# Altium project scoreboard.PrjPcb
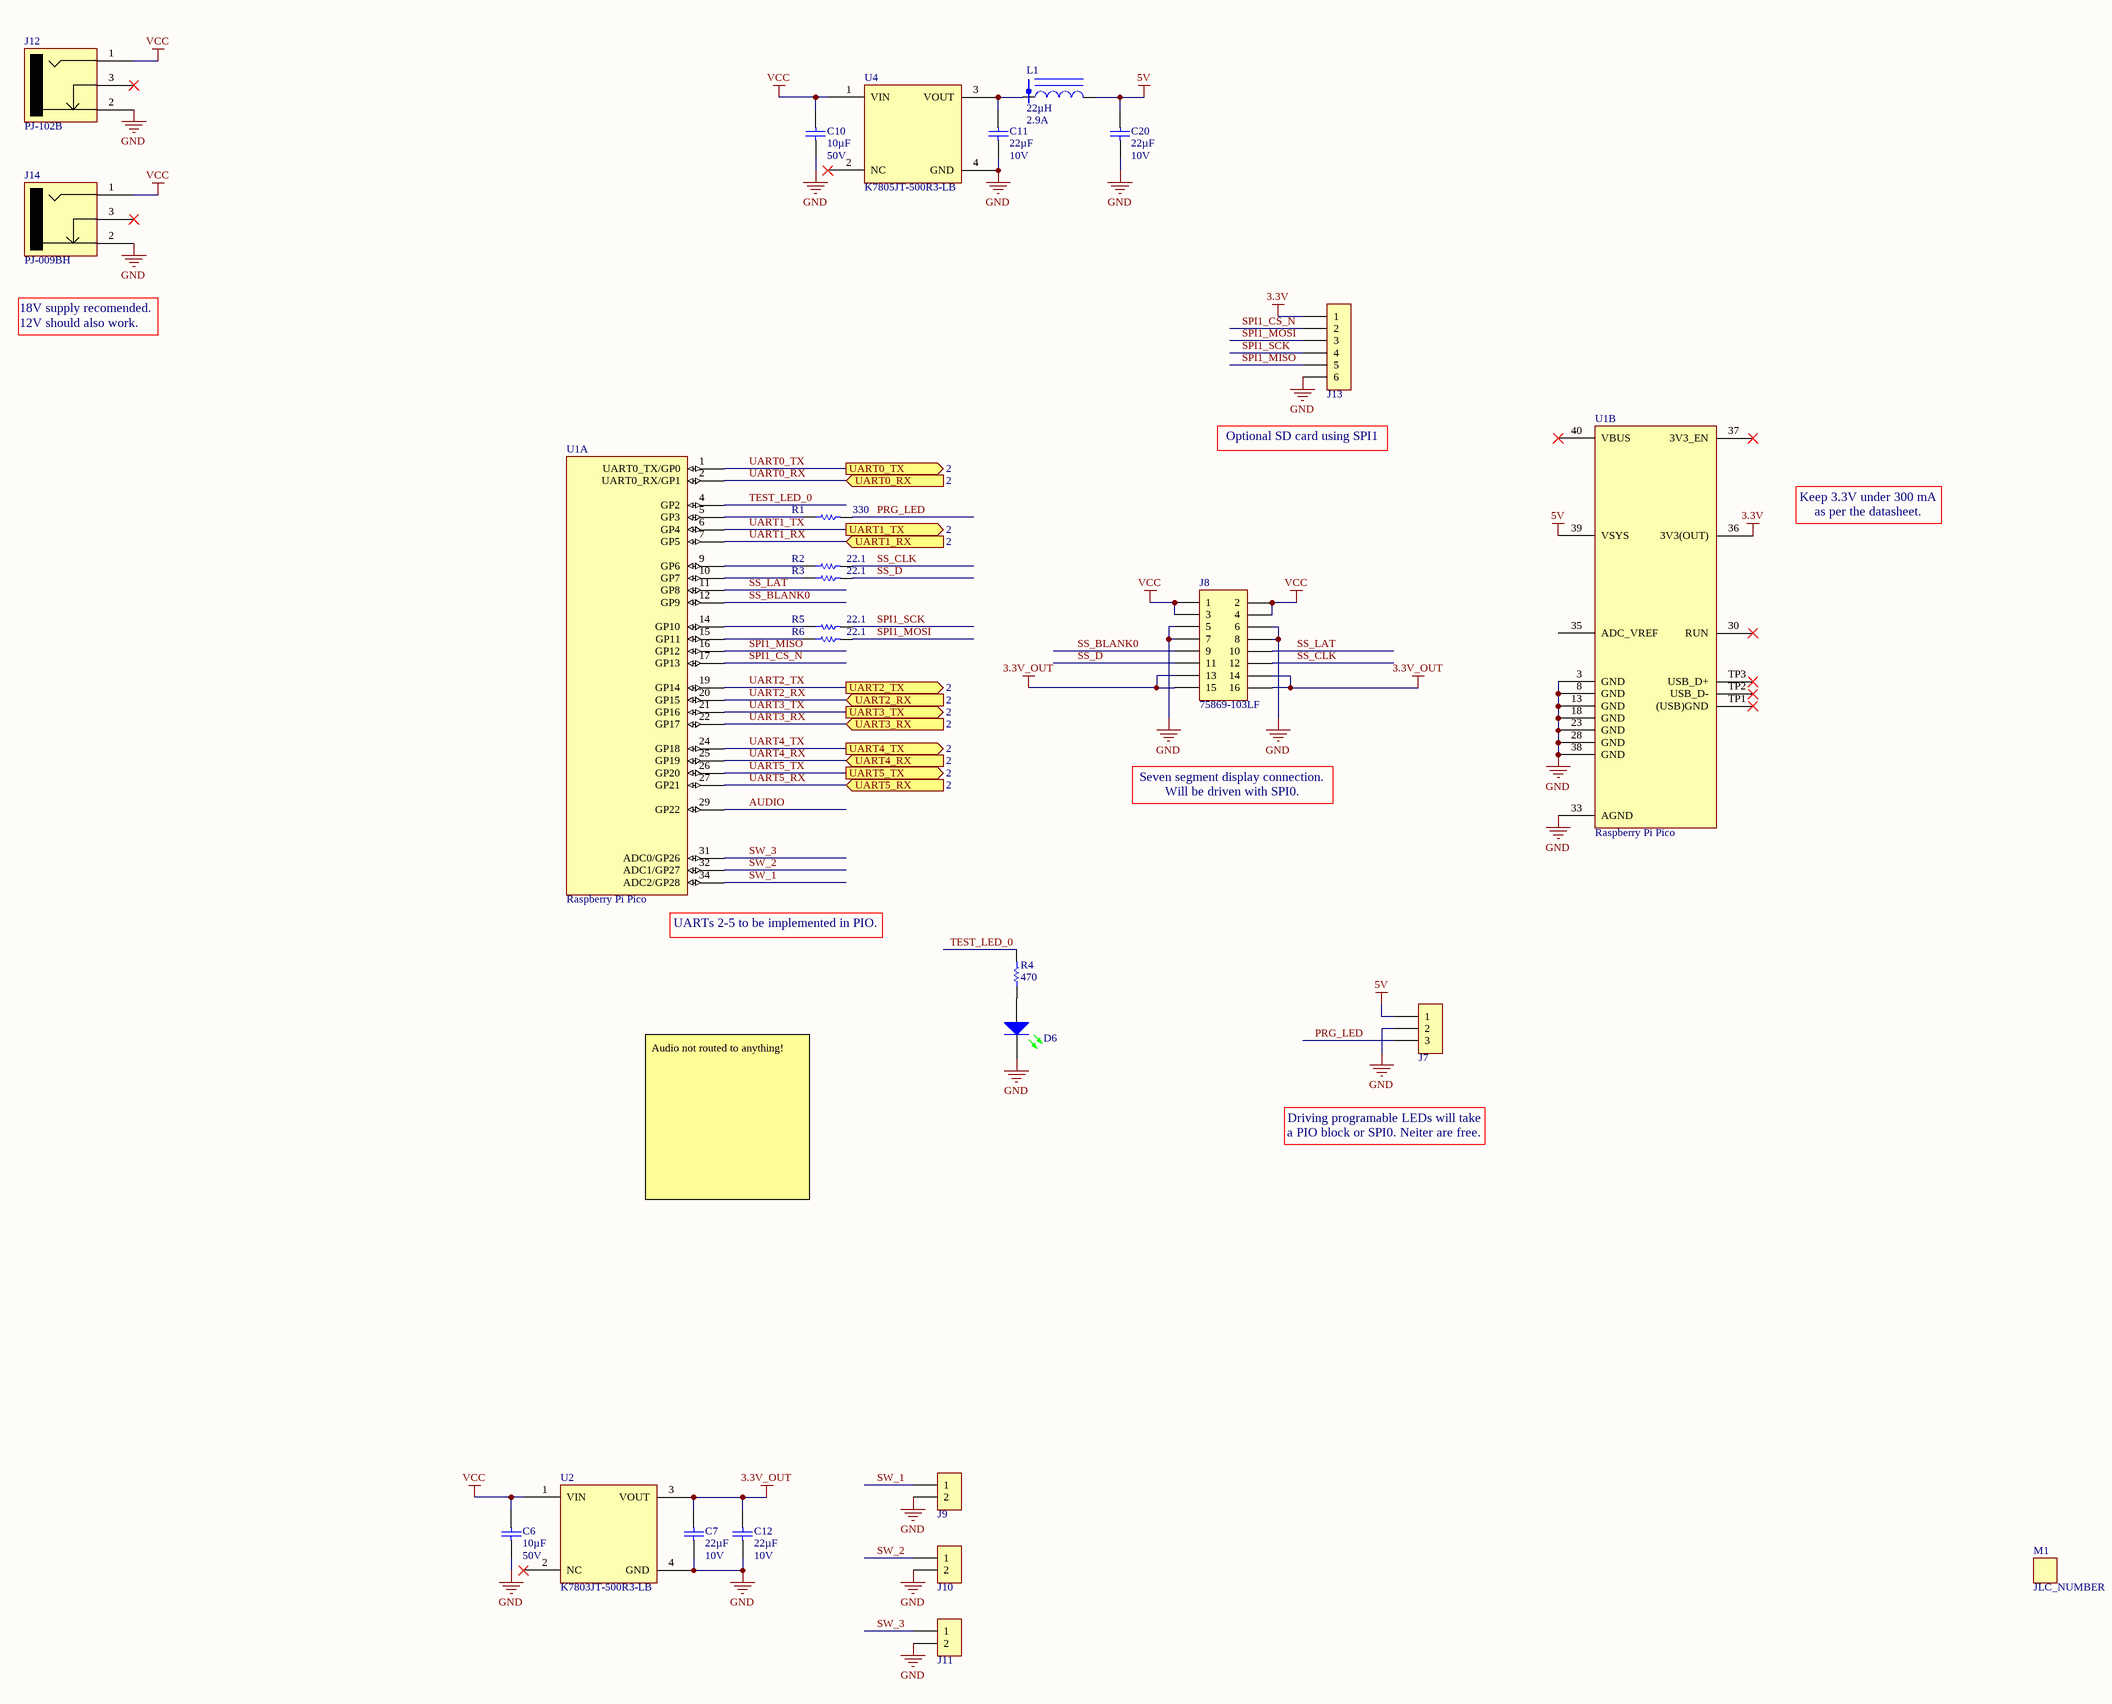
[diagram p0: pico.SchDoc]
BOMRev: A; Codename: Scoreboard; HardRev: A; LeadEngineer: JCF
2 sheets, 56 parts. Net scope: flat (ports and power ports of the same name join across sheets).
Board file: scoreboard.PcbDoc
Sheets:
  pico.SchDoc
  RS232.SchDoc

## Sheet pico.SchDoc: Pico
size C; DocumentNumber: 1; SheetNumber: 1; SheetTotal: 2

### Parts
C6  10µF  Voltage: 50V  [Chip1206]
C7  22µF  Voltage: 10V  [Chip0805]
C10  10µF  Voltage: 50V  [Chip1206]
C11  22µF  Voltage: 10V  [Chip0805]
C12  22µF  Voltage: 10V  [Chip0805]
C20  22µF  Voltage: 10V  [Chip0805]
D6  GREEN  [LED0603]  (value not drawn)
J7  3-644456-3  [TE_3-644456-3]  (value not drawn)
J8  75869-103LF  [IDC_100_2x8]
J9  B2B-XH-A  [JST_B2B-XH-A]  (value not drawn)
J10  B2B-XH-A  [JST_B2B-XH-A]  (value not drawn)
J11  B2B-XH-A  [JST_B2B-XH-A]  (value not drawn)
J12  PJ-102B  [CUI_PJ-102B]
J13  3-644456-6  [TE_3-644456-6]  (value not drawn)
J14  PJ-009BH  [CUI_PJ-009BH]
L1  22µH  Current Rating: 2.9A  [Sumida_CDRH105R]
M1  JLC_NUMBER  [JLC_NUMBER]  (no BOM)
R1  330  [Chip0805]
R2  22.1  [Chip0805]
R3  22.1  [Chip0805]
R4  470  [Chip0805]
R5  22.1  [Chip0805]
R6  22.1  [Chip0805]
U1  Raspberry Pi Pico  [RASPBERRY_PI_PICO]  (parts A,B of 2)
U2  K7803JT-500R3-LB  [MORNSUN_K78XXJT-500R3-LB]
U4  K7805JT-500R3-LB  [MORNSUN_K78XXJT-500R3-LB]

### Ports
UART0_RX (in, see 2), UART0_TX (out, see 2), UART1_RX (in, see 2), UART1_TX (out, see 2), UART2_RX (in, see 2), UART2_TX (out, see 2), UART3_RX (in, see 2), UART3_TX (out, see 2), UART4_RX (in, see 2), UART4_TX (out, see 2), UART5_RX (in, see 2), UART5_TX (out, see 2)

### Nets
3.3V: J13.1 U1.36(3V3(OUT))
3.3V_OUT: C7.2 C12.2 J8.13 J8.14 J8.15 J8.16 U2.3(VOUT)
5V: C20.2 J7.1 L1.2 U1.39(VSYS)
GND: C6.1 C7.1 C10.1 C11.1 C12.1 C20.1 D6.2(C) J7.2 J8.5 J8.6 J8.7 J8.8 J9.2 J10.2 J11.2 J12.2 J13.6 J14.2 U1.3(GND) U1.8(GND) U1.13(GND) U1.18(GND) U1.23(GND) U1.28(GND) U1.33(AGND) U1.38(GND) U2.4(GND) U4.4(GND)
VCC: C6.2 C10.2 J8.1 J8.2 J8.3 J8.4 J12.1 J14.1 U2.1(VIN) U4.1(VIN)
AUDIO: U1.29(GP22)
PRG_LED: J7.3 R1.2
SPI1_CS_N: J13.2 U1.17(GP13)
SPI1_MISO: J13.5 U1.16(GP12)
SPI1_MOSI: J13.3 R6.2
SPI1_SCK: J13.4 R5.2
SS_BLANK0: J8.9 U1.12(GP9)
SS_CLK: J8.12 R2.2
SS_D: J8.11 R3.2
SS_LAT: J8.10 U1.11(GP8)
SW_1: J9.1 U1.34(ADC2/GP28)
SW_2: J10.1 U1.32(ADC1/GP27)
SW_3: J11.1 U1.31(ADC0/GP26)
TEST_LED_0: R4.2 U1.4(GP2)
UART0_RX: U1.2(UART0_RX/GP1) ; port UART0_RX
UART0_TX: U1.1(UART0_TX/GP0) ; port UART0_TX
UART1_RX: U1.7(GP5) ; port UART1_RX
UART1_TX: U1.6(GP4) ; port UART1_TX
UART2_RX: U1.20(GP15) ; port UART2_RX
UART2_TX: U1.19(GP14) ; port UART2_TX
UART3_RX: U1.22(GP17) ; port UART3_RX
UART3_TX: U1.21(GP16) ; port UART3_TX
UART4_RX: U1.25(GP19) ; port UART4_RX
UART4_TX: U1.24(GP18) ; port UART4_TX
UART5_RX: U1.27(GP21) ; port UART5_RX
UART5_TX: U1.26(GP20) ; port UART5_TX
NetC11_2: C11.2 L1.1 U4.3(VOUT)
NetD6_1: D6.1(A) R4.1
NetR1_1: R1.1 U1.5(GP3)
NetR2_1: R2.1 U1.9(GP6)
NetR3_1: R3.1 U1.10(GP7)
NetR5_1: R5.1 U1.14(GP10)
NetR6_1: R6.1 U1.15(GP11)

Not connected (* = marked no-connect by the designer): J12 3*; J14 3*; U1 30(RUN)* 35(ADC_VREF) 37(3V3_EN)* 40(VBUS)* TP1((USB)GND)* TP2(USB_D-)* TP3(USB_D+)*; U2 2(NC)*; U4 2(NC)*

### Notes on the sheet
- 18V supply recomended. 12V should also work.
- Optional SD card using SPI1
- Keep 3.3V under 300 mA as per the datasheet.
- Seven segment display connection. Will be driven with SPI0.
- (near U1) UARTs 2-5 to be implemented in PIO.
- Driving programable LEDs will take a PIO block or SPI0. Neiter are free.
- Audio not routed to anything!
- Title:
- This work is licensed under a Creative Commons Attribution 4.0 International License. Derivative works should remove all Sophistry branding and ‘é’ watermark.
- Date:
- Engineer:
- Revision:
- Codename:
- Time:
- Variant:
- Sheet
- of

### Library data of the parts
C6 C10 = C3216X5R1H106K160AB: CAP CER 10UF 50V 10% X5R 1206; Manufacturer: TDK Corporation; PartNumber: C3216X5R1H106K160AB; HelpURL: http://product.tdk.com/capacitor/mlcc/en/documents/mlcc_commercial_general_en.pdf; Supplier 1: Digi-Key; Supplier Part Number 1: 445-5998-1-ND; Supplier 2: Mouser; Manufacturer Part Number: C3216X5R1H106K160AB; Series: C; Capacitance: 10µF; Tolerance: ±10%; Temperature Coefficient: X5R; Mounting Type: Surface Mount, MLCC; Operating Temperature: -55°C ~ 85°C; Applications: General Purpose; Ratings: -; Package / Case: 1206 (3216 Metric); Size / Dimension: 0.126" L x 0.063" W (3.20mm x 1.60mm); Height - Seated (Max): -; Thickness (Max): 0.071" (1.80mm); Lead Spacing: -; Features: -; Lead Style: -
C7 C11 C12 C20 = C2012X5R1A226M085AC: CAP CER 22UF 10V 20% X5R 0805; Manufacturer: TDK Corporation; PartNumber: C2012X5R1A226M085AC; HelpURL: http://product.tdk.com/capacitor/mlcc/en/documents/mlcc_commercial_general_en.pdf; Supplier 1: Digi-Key; Supplier Part Number 1: 445-7663-1-ND; Supplier 2: Mouser; Manufacturer Part Number: C2012X5R1A226M085AC; Series: C; Capacitance: 22µF; Tolerance: ±20%; Temperature Coefficient: X5R; Mounting Type: Surface Mount, MLCC; Operating Temperature: -55°C ~ 85°C; Applications: General Purpose; Ratings: -; Package / Case: 0805 (2012 Metric); Size / Dimension: 0.079" L x 0.049" W (2.00mm x 1.25mm); Height - Seated (Max): -; Thickness (Max): 0.037" (0.95mm); Lead Spacing: -; Features: -; Lead Style: -
D6 = LTST-C191GKT: LED GREEN CLEAR THIN 0603 SMD; Manufacturer: Lite-On Inc; PartNumber: LTST-C191GKT; Datasheets: http://optoelectronics.liteon.com/upload/download/DS22-2000-300/S_110_LTST-C191TGKT.pdf; Supplier 1: Digi-Key; Supplier Part Number 1: 160-1443-1-ND; Supplier 2: Mouser; Supplier Part Number 2: 859-LTST-C191GKT; Manufacturer Part Number: LTST-C191GKT; Color: Green
J7 = 3-644456-3: CONN HEADER VERT 3POS .100 TIN; Manufacturer: TE Connectivity; PartNumber: 3-644456-3; Supplier 1: Digi-Key; Supplier 2: Mouser; Supplier Part Number 2: 571-3-644456-3; HelpURL: http://www.te.com/commerce/DocumentDelivery/DDEController?Action=srchrtrv&DocNm=644456&DocType=Customer+Drawing&DocLang=English; Supplier Part Number 1: A31113-ND; Manufacturer Part Number: 3-644456-3
J8 = 75869-103LF: CONN HEADER 16POS DUAL VERT PCB; Manufacturer: FCI; PartNumber: 75869-103LF; Supplier 1: Digi-Key; Supplier 2: Mouser; Supplier Part Number 2: 649-75869-103LF; HelpURL: http://portal.fciconnect.com/Comergent//fci/drawing/75869.pdf; Supplier Part Number 1: 609-1775-ND; Manufacturer Part Number: 75869-103LF
J9-J11 = B2B-XH-A: CONN HEADER VERT 2POS 2.5MM; Manufacturer: JST Sales America Inc.; PartNumber: B2B-XH-A; Supplier 1: Digi-Key; Supplier 2: Mouser; HelpURL: https://www.jst-mfg.com/product/pdf/eng/eXH.pdf; Supplier Part Number 1: 455-B2B-XH-A-ND; Manufacturer Part Number: B2B-XH-A
J12 = PJ-102B: CONN PWR JACK 2.5X5.5MM SOLDER; Manufacturer: CUI Devices; PartNumber: PJ-102B; HelpURL: https://www.cuidevices.com/product/resource/pj-102b.pdf; Supplier 1: Digi-Key; Supplier Part Number 1: CP-102B-ND; Supplier 2: Mouser; Supplier Part Number 2: 490-PJ-102B; Manufacturer Part Number: PJ-102B
J13 = 3-644456-6: CONN HEADER VERT 6POS .100 TIN; Manufacturer: TE Connectivity; PartNumber: 3-644456-6; Supplier 1: Digi-Key; Supplier 2: Mouser; Supplier Part Number 2: 571-3-644456-6; HelpURL: http://www.te.com/commerce/DocumentDelivery/DDEController?Action=srchrtrv&DocNm=644456&DocType=Customer+Drawing&DocLang=English; Supplier Part Number 1: A31116-ND; Manufacturer Part Number: 3-644456-6
J14 = PJ-009BH: CONN PWR JACK 2.5X5.5MM SOLDER; Manufacturer: CUI Devices; PartNumber: PJ-009BH; HelpURL: https://www.cuidevices.com/product/resource/pj-009bh.pdf; Supplier 1: Digi-Key; Supplier Part Number 1: CP-009BH-ND; Supplier 2: Mouser; Supplier Part Number 2: 490-PJ-009BH; Manufacturer Part Number: PJ-009BH
L1 = CDRH105RNP-220NC: INDUCTOR POWER 22UH 2.95A SMD; Manufacturer: Sumida America Components Inc; Type: 0; Material - Core: Ferrite; Tolerance: ±30%; Shielding: Shielded; DC Resistance (DCR): 61 mOhm Max; Frequency - Test: 100kHz; PartNumber: CDRH105RNP-220NC; Supplier 1: Digi-Key; Supplier 2: Mouser; HelpURL: http://www.sumida.com/products/pdf/CDRH105R.pdf; Supplier Part Number 1: 308-2173-1-ND; Manufacturer Part Number: CDRH105RNP-220NC; Series: CDRH105R; Inductance: 22µH; Current - Saturation: 2.95A; Q @ Freq: 0; Frequency - Self Resonant: 0; Operating Temperature: -40°C ~ 100°C; Mounting Type: Surface Mount; Package / Case: Non Standard; Size / Dimension: 0.402" L x 0.394" W (10.20mm x 10.00mm); Height - Seated (Max): 0.201" (5.10mm)
M1 = JLC_NUMBER: JLC Order Number Location; PartNumber: JLC_NUMBER; Manufacturer Part Number: JLC_NUMBER
R1 = CRCW0805330RFKEA: RES 330 OHM 1/8W 1% 0805 SMD; Manufacturer: Vishay Dale; Power (Watts): 0.125W, 1/8W; Temperature Coefficient: ±100ppm/°C; PartNumber: CRCW0805330RFKEA; HelpURL: http://www.vishay.com/doc?20035; Supplier 1: Digi-Key; Supplier Part Number 1: 541-330CCT-ND; Supplier 2: Mouser; Manufacturer Part Number: CRCW0805330RFKEA; Series: CRCW; Resistance: 330; Tolerance: ±1%; Composition: Thick Film; Features: Automotive AEC-Q200 Qualified; Package / Case: 0805 (2012 Metric); Supplier Device Package: 0805 (2012 Metric); Size / Dimension: 0.079" L x 0.049" W (2.00mm x 1.25mm); Height: 0.020" (0.50mm); Number of Terminations: 2
R2 R3 R5 R6 = CRCW080522R1FKEA: RES 22.1 OHM 1/8W 1% 0805 SMD; Manufacturer: Vishay Dale; Power (Watts): 0.125W, 1/8W; Temperature Coefficient: ±100ppm/°C; PartNumber: CRCW080522R1FKEA; HelpURL: http://www.vishay.com/doc?20035; Supplier 1: Digi-Key; Supplier Part Number 1: 541-22.1CCT-ND; Supplier 2: Mouser; Manufacturer Part Number: CRCW080522R1FKEA; Series: CRCW; Resistance: 22.1; Tolerance: ±1%; Composition: Thick Film; Features: Automotive AEC-Q200 Qualified; Package / Case: 0805 (2012 Metric); Supplier Device Package: 0805 (2012 Metric); Size / Dimension: 0.079" L x 0.049" W (2.00mm x 1.25mm); Height: 0.020" (0.50mm); Number of Terminations: 2
R4 = CRCW0805470RFKEA: RES 470 OHM 1/8W 1% 0805 SMD; Manufacturer: Vishay Dale; Power (Watts): 0.125W, 1/8W; Temperature Coefficient: ±100ppm/°C; PartNumber: CRCW0805470RFKEA; HelpURL: http://www.vishay.com/doc?20035; Supplier 1: Digi-Key; Supplier Part Number 1: 541-470CCT-ND; Supplier 2: Mouser; Manufacturer Part Number: CRCW0805470RFKEA; Series: CRCW; Resistance: 470; Tolerance: ±1%; Composition: Thick Film; Features: Automotive AEC-Q200 Qualified; Package / Case: 0805 (2012 Metric); Supplier Device Package: 0805 (2012 Metric); Size / Dimension: 0.079" L x 0.049" W (2.00mm x 1.25mm); Height: 0.020" (0.50mm); Number of Terminations: 2
U1 = Raspberry Pi Pico: RASPBERRY PI PICO RP2040 BOARD; Manufacturer Part Number: SC0915; PartNumber: Raspberry Pi Pico; Supplier 1: Digi-Key; Supplier Part Number 1: 2648-SC0915CT-ND; Manufacturer: Raspberry Pi
U2 = K7803JT-500R3-LB: LINEAR REGULATOR REPLACEMENT DC; Manufacturer: Mornsun America, LLC; PartNumber: K7803JT-500R3-LB; HelpURL: https://www.mornsun-power.com/html/pdf/K7803JT-500R3-LB.html; Supplier 1: Digi-Key; Supplier Part Number 1: 2725-K7803JT-500R3-LBCT-ND; Manufacturer Part Number: K7803JT-500R3-LB
U4 = K7805JT-500R3-LB: LINEAR REGULATOR REPLACEMENT DC; Manufacturer: Mornsun America, LLC; Output Type: Fixed; Number of Outputs: 1; Voltage - Output: 5V; Voltage - Input: 6.5-36V; Frequency - Switching: 700kHz; Current - Output: 500mA; PartNumber: K7805JT-500R3-LB; HelpURL: https://www.mornsun-power.com/html/pdf/K7805JT-500R3-LB.html; Supplier 1: Digi-Key; Supplier Part Number 1: 2725-K7805JT-500R3-LBCT-ND; Manufacturer Part Number: K7805JT-500R3-LB

## Sheet RS232.SchDoc
size C; DocumentNumber: 2; SheetNumber: 2; SheetTotal: 2
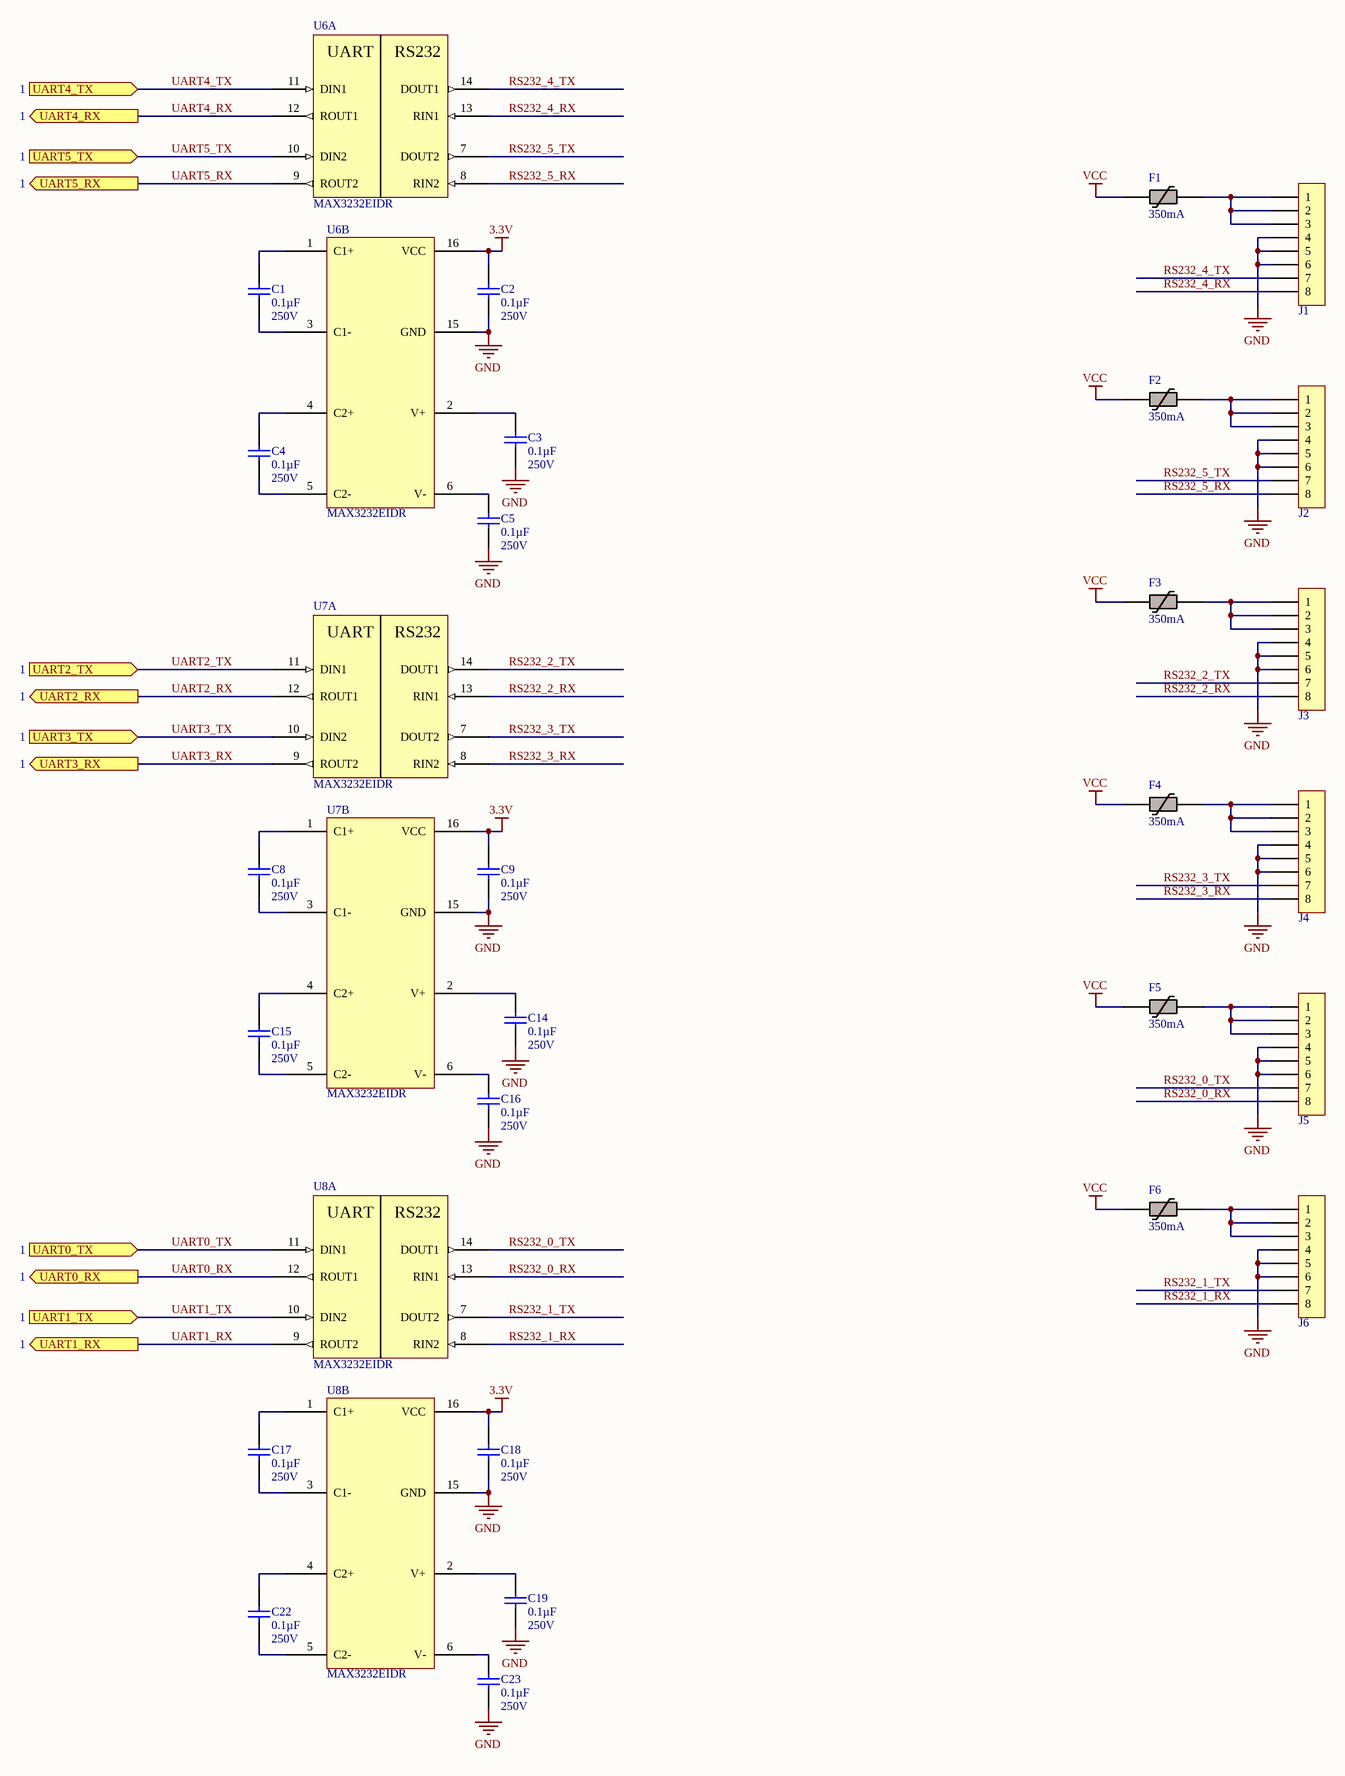
[diagram p1: RS232.SchDoc]

### Parts
C1  0.1µF  Voltage: 250V  [Chip0805]
C2  0.1µF  Voltage: 250V  [Chip0805]
C3  0.1µF  Voltage: 250V  [Chip0805]
C4  0.1µF  Voltage: 250V  [Chip0805]
C5  0.1µF  Voltage: 250V  [Chip0805]
C8  0.1µF  Voltage: 250V  [Chip0805]
C9  0.1µF  Voltage: 250V  [Chip0805]
C14  0.1µF  Voltage: 250V  [Chip0805]
C15  0.1µF  Voltage: 250V  [Chip0805]
C16  0.1µF  Voltage: 250V  [Chip0805]
C17  0.1µF  Voltage: 250V  [Chip0805]
C18  0.1µF  Voltage: 250V  [Chip0805]
C19  0.1µF  Voltage: 250V  [Chip0805]
C22  0.1µF  Voltage: 250V  [Chip0805]
C23  0.1µF  Voltage: 250V  [Chip0805]
F1  350mA  [Chip1812]
F2  350mA  [Chip1812]
F3  350mA  [Chip1812]
F4  350mA  [Chip1812]
F5  350mA  [Chip1812]
F6  350mA  [Chip1812]
J1  949  [KEYSTONE_949]  (value not drawn)
J2  949  [KEYSTONE_949]  (value not drawn)
J3  949  [KEYSTONE_949]  (value not drawn)
J4  949  [KEYSTONE_949]  (value not drawn)
J5  949  [KEYSTONE_949]  (value not drawn)
J6  949  [KEYSTONE_949]  (value not drawn)
U6  MAX3232EIDR  [16-SOIC]  (parts A,B of 2)
U7  MAX3232EIDR  [16-SOIC]  (parts A,B of 2)
U8  MAX3232EIDR  [16-SOIC]  (parts A,B of 2)

### Ports
UART0_RX (out, see 1), UART0_TX (in, see 1), UART1_RX (out, see 1), UART1_TX (in, see 1), UART2_RX (out, see 1), UART2_TX (in, see 1), UART3_RX (out, see 1), UART3_TX (in, see 1), UART4_RX (out, see 1), UART4_TX (in, see 1), UART5_RX (out, see 1), UART5_TX (in, see 1)

### Nets
3.3V: C2.2 C9.2 C18.2 U6.16(VCC) U7.16(VCC) U8.16(VCC)
GND: C2.1 C3.1 C5.1 C9.1 C14.1 C16.1 C18.1 C19.1 C23.1 J1.4 J1.5 J1.6 J2.4 J2.5 J2.6 J3.4 J3.5 J3.6 J4.4 J4.5 J4.6 J5.4 J5.5 J5.6 J6.4 J6.5 J6.6 U6.15(GND) U7.15(GND) U8.15(GND)
VCC: F1.1 F2.1 F3.1 F4.1 F5.1 F6.1
RS232_0_RX: J5.8 U8.13(RIN1)
RS232_0_TX: J5.7 U8.14(DOUT1)
RS232_1_RX: J6.8 U8.8(RIN2)
RS232_1_TX: J6.7 U8.7(DOUT2)
RS232_2_RX: J3.8 U7.13(RIN1)
RS232_2_TX: J3.7 U7.14(DOUT1)
RS232_3_RX: J4.8 U7.8(RIN2)
RS232_3_TX: J4.7 U7.7(DOUT2)
RS232_4_RX: J1.8 U6.13(RIN1)
RS232_4_TX: J1.7 U6.14(DOUT1)
RS232_5_RX: J2.8 U6.8(RIN2)
RS232_5_TX: J2.7 U6.7(DOUT2)
UART0_RX: U8.12(ROUT1) ; port UART0_RX
UART0_TX: U8.11(DIN1) ; port UART0_TX
UART1_RX: U8.9(ROUT2) ; port UART1_RX
UART1_TX: U8.10(DIN2) ; port UART1_TX
UART2_RX: U7.12(ROUT1) ; port UART2_RX
UART2_TX: U7.11(DIN1) ; port UART2_TX
UART3_RX: U7.9(ROUT2) ; port UART3_RX
UART3_TX: U7.10(DIN2) ; port UART3_TX
UART4_RX: U6.12(ROUT1) ; port UART4_RX
UART4_TX: U6.11(DIN1) ; port UART4_TX
UART5_RX: U6.9(ROUT2) ; port UART5_RX
UART5_TX: U6.10(DIN2) ; port UART5_TX
NetC1_1: C1.1 U6.3(C1-)
NetC1_2: C1.2 U6.1(C1+)
NetC3_2: C3.2 U6.2(V+)
NetC4_1: C4.1 U6.5(C2-)
NetC4_2: C4.2 U6.4(C2+)
NetC5_2: C5.2 U6.6(V-)
NetC8_1: C8.1 U7.3(C1-)
NetC8_2: C8.2 U7.1(C1+)
NetC14_2: C14.2 U7.2(V+)
NetC15_1: C15.1 U7.5(C2-)
NetC15_2: C15.2 U7.4(C2+)
NetC16_2: C16.2 U7.6(V-)
NetC17_1: C17.1 U8.3(C1-)
NetC17_2: C17.2 U8.1(C1+)
NetC19_2: C19.2 U8.2(V+)
NetC22_1: C22.1 U8.5(C2-)
NetC22_2: C22.2 U8.4(C2+)
NetC23_2: C23.2 U8.6(V-)
NetF1_2: F1.2 J1.1 J1.2 J1.3
NetF2_2: F2.2 J2.1 J2.2 J2.3
NetF3_2: F3.2 J3.1 J3.2 J3.3
NetF4_2: F4.2 J4.1 J4.2 J4.3
NetF5_2: F5.2 J5.1 J5.2 J5.3
NetF6_2: F6.2 J6.1 J6.2 J6.3

### Notes on the sheet
- Title:
- This work is licensed under a Creative Commons Attribution 4.0 International License. Derivative works should remove all Sophistry branding and ‘é’ watermark.
- Date:
- Engineer:
- Revision:
- Codename:
- Time:
- Variant:
- Sheet
- of
- (in symbol MAX3232EIDR, part A) UART; RS232

### Library data of the parts
C1-C5 C8 C9 C14-C19 C22 C23 = C2012X7T2E104K125AA: CAP CER 0.1UF 250V 10% X7T 0805; Manufacturer: TDK Corporation; PartNumber: C2012X7T2E104K125AA; HelpURL: http://product.tdk.com/capacitor/mlcc/en/documents/mlcc_commercial_midvoltage_en.pdf; Supplier 1: Digi-Key; Supplier Part Number 1: 445-7749-1-ND; Supplier 2: Mouser; Manufacturer Part Number: C2012X7T2E104K125AA; Series: C; Capacitance: 0.1µF; Tolerance: ±10%; Temperature Coefficient: X7T; Mounting Type: Surface Mount, MLCC; Operating Temperature: -55°C ~ 125°C; Applications: General Purpose; Ratings: -; Package / Case: 0805 (2012 Metric); Size / Dimension: 0.079" L x 0.049" W (2.00mm x 1.25mm); Height - Seated (Max): -; Thickness (Max): 0.057" (1.45mm); Lead Spacing: -; Features: -; Lead Style: -
F1-F6 = 0ZCG0035AF2C: PTC RESET FUSE 30V 350MA 1812; Manufacturer: Bel Fuse Inc.; PartNumber: 0ZCG0035AF2C; HelpURL: https://www.belfuse.com/resources/datasheets/circuitprotection/ds-cp-0zcg-series.pdf; Supplier 1: Digi-Key; Supplier Part Number 1: 507-1760-1-ND; Supplier 2: Mouser; Supplier Part Number 2: 530-0ZCG0035AF2C; Supplier 3: LCSC; Supplier Part Number 3: C3762402; Manufacturer Part Number: 0ZCG0035AF2C; Current_Hold: 350mA
J1-J6 = 949: CONN MOD JACK 8P8C VERT UNSHLD; Manufacturer: Keystone Electronics; PartNumber: 949; HelpURL: https://www.keyelco.com/product-pdf.cfm?p=14078; Supplier 1: Digi-Key; Supplier Part Number 1: 36-949-ND; Supplier 2: Mouser; Supplier Part Number 2: 534-949; Manufacturer Part Number: 949
U6-U8 = MAX3232EIDR: IC TRANSCEIVER FULL 2/2 16SOIC; Manufacturer: Texas Instruments; PartNumber: MAX3232EIDR; Supplier 1: Digi-Key; Supplier 2: Mouser; Supplier Part Number 2: 595-MAX3232EIDR; HelpURL: https://www.ti.com/lit/ds/symlink/max3232e.pdf?HQS=dis-dk-null-digikeymode-dsf-pf-null-wwe&ts=1710373009473&ref_url=https%253A%252F%252Fwww.ti.com%252Fgeneral%252Fdocs%252Fsuppproductinfo.tsp%253FdistId%253D10%2526gotoUrl%253Dhttps%253A%252F%252Fwww.ti.com%252Flit%252Fgpn%252Fmax3232e; Supplier Part Number 1: 296-19752-1-ND; Manufacturer Part Number: MAX3232EIDR

## Nets that join several sheets
3.3V: pico (J13.1 U1.36), RS232 (6 pins)
GND: pico (28 pins), RS232 (30 pins)
VCC: pico (10 pins), RS232 (6 pins)
UART0_RX: pico (U1.2), RS232 (U8.12)
UART0_TX: pico (U1.1), RS232 (U8.11)
UART1_RX: pico (U1.7), RS232 (U8.9)
UART1_TX: pico (U1.6), RS232 (U8.10)
UART2_RX: pico (U1.20), RS232 (U7.12)
UART2_TX: pico (U1.19), RS232 (U7.11)
UART3_RX: pico (U1.22), RS232 (U7.9)
UART3_TX: pico (U1.21), RS232 (U7.10)
UART4_RX: pico (U1.25), RS232 (U6.12)
UART4_TX: pico (U1.24), RS232 (U6.11)
UART5_RX: pico (U1.27), RS232 (U6.9)
UART5_TX: pico (U1.26), RS232 (U6.10)